# Altium schematic sheet Power.SchDoc (part 2 of 3)
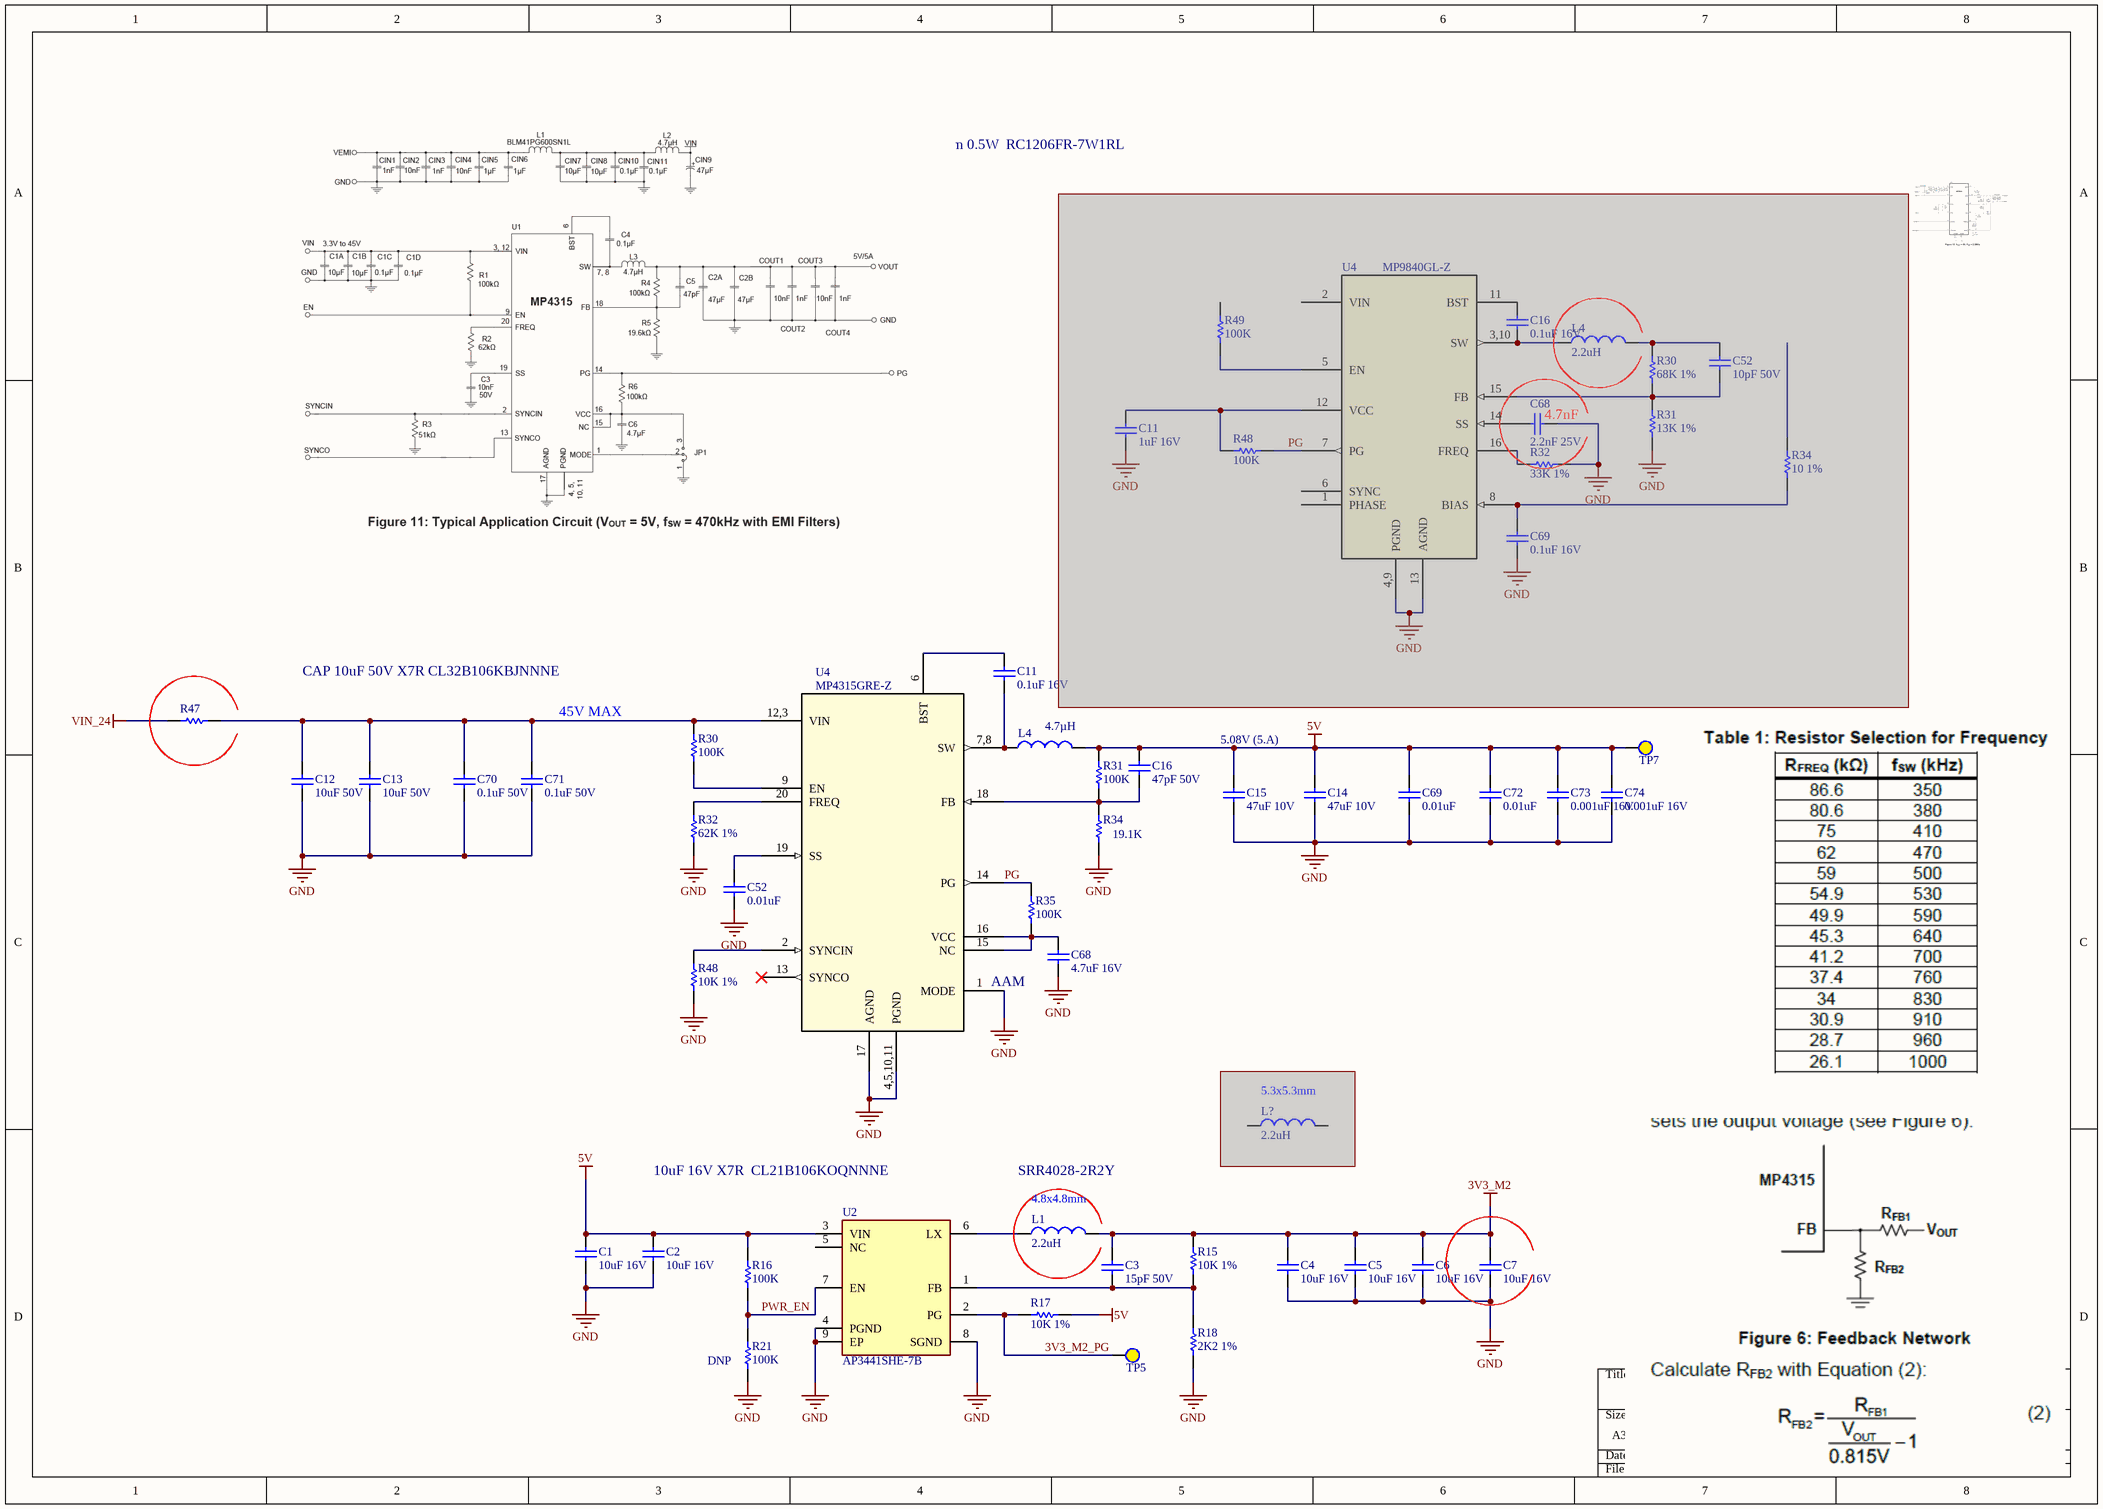
[diagram p1: Power.SchDoc]
## Library data of the parts
C1 C2 C4-C7 = Cap10UF_16V_0805_X7R: 16V 10uF X7R ±10% 0805 Multilayer Ceramic Capacitors MLCC - SMD/SMT ROHS; Manufacturer: Samsung Electro-Mechanics; Manufacturer Part Number: CL21B106KOQNNNE; Value: 10µF; Supplier 1: Mouser; Supplier Part Number 1: 187-CL21B106KOQNNNE; Supplier: Mouser; Supplier Part Number: 187-CL21B106KOQNNNE; RoHS: Compliant; Category: Ceramic Capacitors; Stock: 602217; Pricing: 1=0.22, 1=0.189, 10=0.133, 10=0.114, 50=0.133, 100=0.069, 100=0.08, 500=0.055, 1000=0.054, 1000=0.046, 2000=0.046, 4000=0.04, 10000=0.044, 10000=0.038, 24000=0.037 (USD); ComponentLink1URL: https://datasheet.octopart.com:443/CL21B106KOQNNNE-Samsung-Electro-Mechanics-datasheet-136482503.pdf?src-supplier=IHS; ComponentLink1Description: https://datasheet.octopart.com:443/CL21B106KOQNNNE-Samsung-Electro-Mechanics-datasheet-136482503.pdf?src-supplier=IHS; Case/Package: 0805; Case Code (Imperial): 0805; Case Code (Metric): 2012; China RoHS: Compliant; Contact Plating: Tin; Depth: 1.25mm; Dielectric: X7R; Dielectric Material: Ceramic; Height: 1.4mm; Length: 2mm; Lifecycle Status: Production; Material: Ceramic; Max Operating Temperature: 125°C; Min Operating Temperature: -55°C; Mounting Technology: Surface Mount; Number of Terminals: 2; Radiation Hardening: No; REACH SVHC: Yes; Schedule B: 8532240020, 8532240020|8532240020, 8532240020|8532240020|8532240020, 8532240020|8532240020|8532240020|8532240020; Thickness: 1.397mm; Tolerance: 10%; Voltage: 16V; Voltage Rating: 16V; Voltage Rating (DC): 16V; Width: 1.25mm; ComponentLink2URL: https://datasheet.octopart.com:443/CL21B106KOQNNNE-Samsung-Electro-Mechanics-datasheet-116891046.pdf?src-supplier=Future+Electronics; ComponentLink2Description: https://datasheet.octopart.com:443/CL21B106KOQNNNE-Samsung-Electro-Mechanics-datasheet-116891046.pdf?src-supplier=Future+Electronics; ComponentLink3URL: https://datasheet.octopart.com:443/CL21B106KOQNNNE-Samsung-Electro-Mechanics-datasheet-81462191.pdf?src-supplier=Future+Electronics; ComponentLink3Description: https://datasheet.octopart.com:443/CL21B106KOQNNNE-Samsung-Electro-Mechanics-datasheet-81462191.pdf?src-supplier=Future+Electronics; ComponentLink4URL: https://datasheet.octopart.com:443/CL21B106KOQNNNE-Samsung-datasheet-12530662.pdf?src-supplier=Future+Electronics; ComponentLink4Description: https://datasheet.octopart.com:443/CL21B106KOQNNNE-Samsung-datasheet-12530662.pdf?src-supplier=Future+Electronics; ComponentLink5URL: https://datasheet.octopart.com:443/CL21B106KOQNNNE-Samsung-datasheet-26669285.pdf?src-supplier=Future+Electronics; ComponentLink5Description: https://datasheet.octopart.com:443/CL21B106KOQNNNE-Samsung-datasheet-26669285.pdf?src-supplier=Future+Electronics; ComponentLink6URL: https://datasheet.octopart.com:443/CL21B106KOQNNNE-Samsung-Electro-Mechanics-datasheet-149045986.pdf?src-supplier=Future+Electronics; ComponentLink6Description: https://datasheet.octopart.com:443/CL21B106KOQNNNE-Samsung-Electro-Mechanics-datasheet-149045986.pdf?src-supplier=Future+Electronics; ComponentLink7URL: https://datasheet.octopart.com/CL21B106KOQNNNE-Samsung-Electro-Mechanics-datasheet-97040617.pdf; ComponentLink7Description: https://datasheet.octopart.com/CL21B106KOQNNNE-Samsung-Electro-Mechanics-datasheet-97040617.pdf; ComponentLink8URL: https://datasheet.octopart.com/CL21B106KOQNNNE-Samsung-Electro-Mechanics-datasheet-8324245.pdf; ComponentLink8Description: https://datasheet.octopart.com/CL21B106KOQNNNE-Samsung-Electro-Mechanics-datasheet-8324245.pdf; ComponentLink9URL: https://datasheet.octopart.com/General-Multilayer-Ceramic-Capacitors-Samsung-datasheet-family-111.pdf; ComponentLink9Description: https://datasheet.octopart.com/General-Multilayer-Ceramic-Capacitors-Samsung-datasheet-family-111.pdf; ComponentLink10URL: https://datasheet.octopart.com:443/CL21B106KOQNNNE-Samsung-Electro-Mechanics-datasheet-11806859.pdf?src-supplier=Arrow+Electronics; ComponentLink10Description: https://datasheet.octopart.com:443/CL21B106KOQNNNE-Samsung-Electro-Mechanics-datasheet-11806859.pdf?src-supplier=Arrow+Electronics; ComponentLink11URL: https://datasheet.octopart.com:443/CL21B106KOQNNNE-Samsung-datasheet-8326407.pdf?src-supplier=TME; ComponentLink11Description: https://datasheet.octopart.com:443/CL21B106KOQNNNE-Samsung-datasheet-8326407.pdf?src-supplier=TME; ComponentLink12URL: http://sigma.octopart.com:80/rohs_certificate/General-Multilayer-Ceramic-Capacitors-Samsung-family-110.pdf?src-supplier=Compliance+Statements; ComponentLink12Description: http://sigma.octopart.com:80/rohs_certificate/General-Multilayer-Ceramic-Capacitors-Samsung-family-110.pdf?src-supplier=Compliance+Statements; ComponentLink13URL: http://sigma.octopart.com:80/rohs_statement/General-Multilayer-Ceramic-Capacitors-Samsung-family-132.pdf?src-supplier=Compliance+Statements; ComponentLink13Description: http://sigma.octopart.com:80/rohs_statement/General-Multilayer-Ceramic-Capacitors-Samsung-family-132.pdf?src-supplier=Compliance+Statements; ComponentLink14URL: http://sigma.octopart.com:80/reach_statement/General-Multilayer-Ceramic-Capacitors-Samsung-family-133.pdf?src-supplier=Compliance+Statements; ComponentLink14Description: http://sigma.octopart.com:80/reach_statement/General-Multilayer-Ceramic-Capacitors-Samsung-family-133.pdf?src-supplier=Compliance+Statements
C3 = Cap15PF_50V: Multilayer Ceramic Capacitor, 15 pF, 50 V, ± 5%, C0G (NP0), 0402 [1005 Metric]; Manufacturer: KEMET; Manufacturer Part Number: C0402C150J5GACTU; Material: 4241ConductorMaterial; Temperature Coefficient: 30ppm/°C; Dissipation Factor: 0.1%; Supplier 1: Mouser; Supplier Part Number 1: 80-C0402C150J5G; Supplier: Mouser; Supplier Part Number: 80-C0402C150J5G; RoHS: Yes; Category: Ceramic Capacitors; Stock: 101858; Pricing: 1=0.1, 10=0.017, 50=0.017, 100=0.009, 1000=0.007, 10000=0.004 (USD); Mounting Technology: Surface Mount,PCB; Case/Package: 0402; Pins: 2; Case Code (Imperial): 0402; Case Code (Metric): 1005; Min Operating Temperature: -55°C; Max Operating Temperature: 125°C; Voltage Rating (DC): 50V; Value: 15pF; Tolerance: 5%; Packaging: Tape and Reel; Dielectric: C0G; Voltage Rating: 50V; Package Quantity: 10000; Termination: SMD/SMT; Series: SMD Comm C0G; Construction: Flat; Voltage Rating (AC): 50V; Length: 1mm; Width: 0.5mm; Height: 0.5mm; Lead Pitch: 0.3mm; Depth: 0.5mm; Radiation Hardening: No; Reach SVHC Compliant: No; Lead Free: 5697LeadFree; RoHS Compliant: Yes; ComponentLink1URL: https://datasheet.ciiva.com/6136/1725418-6136193.pdf?src-supplier=Farnell; ComponentLink1Description: https://datasheet.ciiva.com/6136/1725418-6136193.pdf?src-supplier=Farnell; ComponentLink2URL: https://datasheet.ciiva.com/7378/1372242-7378502.pdf?src-supplier=Newark; ComponentLink2Description: https://datasheet.ciiva.com/7378/1372242-7378502.pdf?src-supplier=Newark; ComponentLink3URL: https://datasheet.ciiva.com/7747/1725418-7747461.pdf?src-supplier=Element14; ComponentLink3Description: https://datasheet.ciiva.com/7747/1725418-7747461.pdf?src-supplier=Element14; ComponentLink4URL: https://datasheet.ciiva.com/5712/kem-c1003-c0g-smd-5712268.pdf?src-supplier=Farnell; ComponentLink4Description: https://datasheet.ciiva.com/5712/kem-c1003-c0g-smd-5712268.pdf?src-supplier=Farnell; ComponentLink5URL: https://datasheet.ciiva.com/7747/kem-c1003-c0g-smd-7747625.pdf?src-supplier=Element14; ComponentLink5Description: https://datasheet.ciiva.com/7747/kem-c1003-c0g-smd-7747625.pdf?src-supplier=Element14; ComponentLink6URL: https://datasheet.ciiva.com/32378/kemet-c0402cxx-eng-tds-32378380.pdf?src-supplier=Distrelec; ComponentLink6Description: https://datasheet.ciiva.com/32378/kemet-c0402cxx-eng-tds-32378380.pdf?src-supplier=Distrelec; ComponentLink7URL: https://datasheet.ciiva.com/28645/1789732-28645400.pdf?src-supplier=Element14; ComponentLink7Description: https://datasheet.ciiva.com/28645/1789732-28645400.pdf?src-supplier=Element14; ComponentLink8URL: https://datasheet.ciiva.com/14588/70095383-14588188.pdf?src-supplier=Allied+Electronics; ComponentLink8Description: https://datasheet.ciiva.com/14588/70095383-14588188.pdf?src-supplier=Allied+Electronics; ComponentLink9URL: https://datasheet.ciiva.com/5414/kem-c1003-c0g-smd-356956-5414360.pdf?src-supplier=Mouser; ComponentLink9Description: https://datasheet.ciiva.com/5414/kem-c1003-c0g-smd-356956-5414360.pdf?src-supplier=Mouser; ComponentLink10URL: https://datasheet.ciiva.com/18192/getdatasheetpartid-94368-18192437.pdf?src-supplier=Verical; ComponentLink10Description: https://datasheet.ciiva.com/18192/getdatasheetpartid-94368-18192437.pdf?src-supplier=Verical
C11#1 = Cap1UF_16V: Ceramic Capacitor (Surface Mount); Manufacturer: Taiyo Yuden; Manufacturer Part Number: EMK105BJ105KV-F; Capacitance: 1µF; Tolerance: ±10%; Temperature Coefficient: X5R; Supplier 1: Digi-Key; RoHS: RoHS Compliant; Category: Capacitors; Stock 1: 107475; Pricing 1: 1=0.1, 10=0.06, 50=0.0326, 100=0.0275, 250=0.02252, 500=0.01926, 1000=0.015, 5000=0.0125 (USD); Packaging: Cut Tape (CT); Voltage - Rated: 16V; Mounting Type: Surface Mount, MLCC; Operating Temperature: -55°C ~ 85°C; Applications: General Purpose; Ratings: -; Package / Case: 0402 (1005 Metric); Size / Dimension: 0.039" L x 0.020" W (1.00mm x 0.50mm); Height - Seated (Max): -; Thickness (Max): 0.022" (0.55mm); Lead Spacing: -; Features: -; Lead Style: -; ComponentLink1URL: http://ds.yuden.co.jp/TYCOMPAS/ut/detail.do?productNo=EMK105BJ105KV-F&fileName=EMK105BJ105KV-F_SS&mode=specSheetDownload; ComponentLink1Description: http://ds.yuden.co.jp/TYCOMPAS/ut/detail.do?productNo=EMK105BJ105KV-F&fileName=EMK105BJ105KV-F_SS&mode=specSheetDownload; Supplier Part Number 1: 587-2477-1-ND
C11#2 C16#1 C69#1 = Cap0.1UF_16V_X7R: 0402 0.1 uF 16V ±10% Tolerance X7R SMT Multilayer Ceramic Capacitor; Manufacturer: Murata; Manufacturer Part Number: GCM155R71C104KA55J; Value: 100nF; RoHS: Yes; Category: Ceramic Capacitors; Stock 1: 2121057; Pricing 1: 1=0,10000, 10=0,01800, 50=0,01800, 100=0,01500, 1000=0,00900, 10000=0,00700 (USD); Mounting Technology: Surface Mount; Case/Package: 0402; Case Code (Imperial): 0402; Case Code (Metric): 1005; Min Operating Temperature: -55°C; Max Operating Temperature: 125°C; Tolerance: 10%; Voltage Rating: 16V; Voltage Rating (DC): 16V; Packaging: Tape and Reel; Package Quantity: 1; Dielectric: X7R; Termination: SMD/SMT; Series: GCM; Construction: Flat; Length: 1mm; Width: 0.5mm; Height: 0.5mm; Thickness: 0.022inch; Depth: 0.5mm; Ratings: AEC-Q200; Radiation Hardening: No; Lead Free: Lead Free; RoHS Compliant: Yes; ComponentLink1URL: https://datasheet.ciiva.com/11618/product-11618848.pdf?src-supplier=Avnet; ComponentLink1Description: https://datasheet.ciiva.com/11618/product-11618848.pdf?src-supplier=Avnet; ComponentLink2URL: https://datasheet.ciiva.com/16440/gcm155r71c104ka55j-16440393.pdf?src-supplier=Future+Electronics; ComponentLink2Description: https://datasheet.ciiva.com/16440/gcm155r71c104ka55j-16440393.pdf?src-supplier=Future+Electronics; ComponentLink3URL: https://datasheet.ciiva.com/29542/product-29542474.pdf?src-supplier=Digi-Key; ComponentLink3Description: https://datasheet.ciiva.com/29542/product-29542474.pdf?src-supplier=Digi-Key; ComponentLink4URL: https://datasheet.ciiva.com/29542/product-29542475.pdf?src-supplier=Digi-Key; ComponentLink4Description: https://datasheet.ciiva.com/29542/product-29542475.pdf?src-supplier=Digi-Key; Supplier 1: Mouser; Supplier 2: Digi-Key; Supplier Part Number 1: 81-GCM155R71C104KA5J; Supplier Part Number 2: 490-7998-1-ND
C12 C13 = Cap_10uF_50V_1210: Ceramic Capacitor, Multilayer, Ceramic, 50V, 10% +Tol, 10% -Tol, X7R, +-15% TC, 10uF, Surface Mount, 1210 inch; Manufacturer: Samsung Electro-Mechanics; Manufacturer Part Number: CL32B106KBJNNNE; Value: 10µF; Supplier: Mouser; Supplier Part Number: 187-CL32B106KBJNNNE; RoHS: Compliant; Category: Ceramic Capacitors; Stock: 42744; Pricing: 1=0.27, 1=0.232, 10=0.137, 10=0.205, 50=0.137, 100=0.137, 1000=0.112, 1000=0.205, 2000=0.201, 5000=0.197, 10000=0.112, 10000=0.15 (USD); Case/Package: 1210; Material: Ceramic; Min Operating Temperature: -55°C; Max Operating Temperature: 125°C; Tolerance: 10%; Voltage Rating: 50V; Voltage Rating (DC): 50V; Height: 2.7mm; Supplier 1: Mouser; Supplier Part Number 1: 187-CL32B106KBJNNNE; Case Code (Imperial): 1210; Case Code (Metric): 3225; China RoHS: Compliant; Depth: 2.5mm; Dielectric: X7R; Dielectric Material: Ceramic; Lead Free: Lead Free; Length: 3.2mm; Lifecycle Status: Production; Mounting Technology: Surface Mount; Number of Terminals: 2; Radiation Hardening: No; REACH SVHC: Yes; Schedule B: 8532240020, 8532240020|8532240020|8532240020|8532240020|8532240020|8532240020|8532240020|8532240020|8532240020, 8532240020|8532240020|8532240020|8532240020|8532240020|8532240020|8532240020|8532240020|8532240020|8532240020, 8532240020|8532240020|8532240020|8532240020|8532240020|8532240020|8532240020|8532240020|8532240020|8532240020|8532240020; Thickness: 2.6924mm; Voltage: 50V; Width: 2.5mm; ComponentLink1URL: https://datasheet.octopart.com:443/CL32B106KBJNNNE-Samsung-Electro-Mechanics-datasheet-136482661.pdf?src-supplier=Newark; ComponentLink1Description: https://datasheet.octopart.com:443/CL32B106KBJNNNE-Samsung-Electro-Mechanics-datasheet-136482661.pdf?src-supplier=Newark; ComponentLink2URL: https://datasheet.octopart.com:443/CL32B106KBJNNNE-Samsung-Electro-Mechanics-datasheet-136482663.pdf?src-supplier=Newark; ComponentLink2Description: https://datasheet.octopart.com:443/CL32B106KBJNNNE-Samsung-Electro-Mechanics-datasheet-136482663.pdf?src-supplier=Newark; ComponentLink3URL: https://datasheet.octopart.com:443/CL32B106KBJNNNE-Samsung-Electro-Mechanics-datasheet-149049182.pdf?src-supplier=Future+Electronics; ComponentLink3Description: https://datasheet.octopart.com:443/CL32B106KBJNNNE-Samsung-Electro-Mechanics-datasheet-149049182.pdf?src-supplier=Future+Electronics; ComponentLink4URL: https://datasheet.octopart.com:443/CL32B106KBJNNNE-Samsung-Electro-Mechanics-datasheet-116891145.pdf?src-supplier=Future+Electronics; ComponentLink4Description: https://datasheet.octopart.com:443/CL32B106KBJNNNE-Samsung-Electro-Mechanics-datasheet-116891145.pdf?src-supplier=Future+Electronics; ComponentLink5URL: https://datasheet.octopart.com:443/CL32B106KBJNNNE-Samsung-Electro-Mechanics-datasheet-68304316.pdf?src-supplier=Future+Electronics; ComponentLink5Description: https://datasheet.octopart.com:443/CL32B106KBJNNNE-Samsung-Electro-Mechanics-datasheet-68304316.pdf?src-supplier=Future+Electronics; ComponentLink6URL: https://datasheet.octopart.com:443/CL32B106KBJNNNE-Samsung-datasheet-66660282.pdf?src-supplier=Future+Electronics; ComponentLink6Description: https://datasheet.octopart.com:443/CL32B106KBJNNNE-Samsung-datasheet-66660282.pdf?src-supplier=Future+Electronics; ComponentLink7URL: https://datasheet.octopart.com:443/CL32B106KBJNNNE-Samsung-datasheet-58578005.pdf?src-supplier=Future+Electronics; ComponentLink7Description: https://datasheet.octopart.com:443/CL32B106KBJNNNE-Samsung-datasheet-58578005.pdf?src-supplier=Future+Electronics; ComponentLink8URL: https://datasheet.octopart.com:443/CL32B106KBJNNNE-Samsung-datasheet-37081328.pdf?src-supplier=Future+Electronics; ComponentLink8Description: https://datasheet.octopart.com:443/CL32B106KBJNNNE-Samsung-datasheet-37081328.pdf?src-supplier=Future+Electronics; ComponentLink9URL: https://datasheet.octopart.com/CL32B106KBJNNNE-Samsung-Electro-Mechanics-datasheet-97040617.pdf; ComponentLink9Description: https://datasheet.octopart.com/CL32B106KBJNNNE-Samsung-Electro-Mechanics-datasheet-97040617.pdf; ComponentLink10URL: https://datasheet.octopart.com/CL32B106KBJNNNE-Samsung-Electro-Mechanics-datasheet-8324245.pdf; ComponentLink10Description: https://datasheet.octopart.com/CL32B106KBJNNNE-Samsung-Electro-Mechanics-datasheet-8324245.pdf; ComponentLink11URL: https://datasheet.octopart.com/General-Multilayer-Ceramic-Capacitors-Samsung-datasheet-family-111.pdf; ComponentLink11Description: https://datasheet.octopart.com/General-Multilayer-Ceramic-Capacitors-Samsung-datasheet-family-111.pdf; ComponentLink12URL: https://datasheet.octopart.com:443/CL32B106KBJNNNE-Samsung-datasheet-151956608.pdf?src-supplier=SOS+electronic; ComponentLink12Description: https://datasheet.octopart.com:443/CL32B106KBJNNNE-Samsung-datasheet-151956608.pdf?src-supplier=SOS+electronic; ComponentLink13URL: https://datasheet.octopart.com:443/CL32B106KBJNNNE-Samsung-Electro-Mechanics-datasheet-11770601.pdf?src-supplier=Arrow+Electronics; ComponentLink13Description: https://datasheet.octopart.com:443/CL32B106KBJNNNE-Samsung-Electro-Mechanics-datasheet-11770601.pdf?src-supplier=Arrow+Electronics; ComponentLink14URL: https://datasheet.octopart.com:443/CL32B106KBJNNNE-Samsung-datasheet-8326407.pdf?src-supplier=TME; ComponentLink14Description: https://datasheet.octopart.com:443/CL32B106KBJNNNE-Samsung-datasheet-8326407.pdf?src-supplier=TME; ComponentLink15URL: http://sigma.octopart.com:80/rohs_certificate/General-Multilayer-Ceramic-Capacitors-Samsung-family-110.pdf?src-supplier=Compliance+Statements; ComponentLink15Description: http://sigma.octopart.com:80/rohs_certificate/General-Multilayer-Ceramic-Capacitors-Samsung-family-110.pdf?src-supplier=Compliance+Statements; ComponentLink16URL: http://sigma.octopart.com:80/rohs_statement/General-Multilayer-Ceramic-Capacitors-Samsung-family-132.pdf?src-supplier=Compliance+Statements; ComponentLink16Description: http://sigma.octopart.com:80/rohs_statement/General-Multilayer-Ceramic-Capacitors-Samsung-family-132.pdf?src-supplier=Compliance+Statements; ComponentLink17URL: http://sigma.octopart.com:80/reach_statement/General-Multilayer-Ceramic-Capacitors-Samsung-family-133.pdf?src-supplier=Compliance+Statements; ComponentLink17Description: http://sigma.octopart.com:80/reach_statement/General-Multilayer-Ceramic-Capacitors-Samsung-family-133.pdf?src-supplier=Compliance+Statements
C14 C15 = Cap47UF_10V_1210_X7R: Multilayer Ceramic Capacitor, 47 uF, 10 V, ± 20%, X7R, 1210 [3225 Metric]; Manufacturer: Murata; Manufacturer Part Number: GRM32ER71A476ME15L; Material: 4241ConductorMaterial; Height: 2.5mm; Supplier 1: Mouser; RoHS: Yes; Category: Ceramic Capacitors; Mounting Technology: Surface Mount; Case/Package: 1210; Case Code (Metric): 3225; Case Code (Imperial): 1210; Min Operating Temperature: -55°C; Max Operating Temperature: 125°C; Packaging: Tape and Reel; Value: 47uF; Voltage Rating: 10V; Tolerance: 20%; Series: GRM; Length: 3.2mm; Width: 0.098inch; Thickness: 0.106inch; RoHS Compliant: Yes; ComponentLink1URL: https://datasheet.ciiva.com/46441/1754712-46441338.pdf?src-supplier=Element14; ComponentLink1Description: https://datasheet.ciiva.com/46441/1754712-46441338.pdf?src-supplier=Element14; ComponentLink2URL: https://datasheet.ciiva.com/6264/partnumbering-e-01-6264587.pdf?src-supplier=Digikey; ComponentLink2Description: https://datasheet.ciiva.com/6264/partnumbering-e-01-6264587.pdf?src-supplier=Digikey; Supplier Part Number 1: 81-GRM32ER71A476ME5L; Supplier: Mouser; Supplier Part Number: 81-GRM32ER71A476ME5L; Stock: 13198; Pricing: 1=0.85, 10=0.545, 50=0.545, 100=0.436, 1000=0.313, 10000=0.26 (USD); Dielectric: X7R; Package Quantity: 1; Voltage Rating (DC): 10V; Termination: SMD/SMT; Voltage: 10V; Construction: Flat; Depth: 2.5mm; Radiation Hardening: No; Reach SVHC Compliant: No; Lead Free: Lead Free; ComponentLink3URL: https://datasheet.ciiva.com/6264/partnumbering-e-01-6264586.pdf?src-supplier=Digikey; ComponentLink3Description: https://datasheet.ciiva.com/6264/partnumbering-e-01-6264586.pdf?src-supplier=Digikey; ComponentLink4URL: https://datasheet.ciiva.com/6264/partnumbering-e-01-6264588.pdf?src-supplier=Digikey; ComponentLink4Description: https://datasheet.ciiva.com/6264/partnumbering-e-01-6264588.pdf?src-supplier=Digikey; ComponentLink5URL: https://datasheet.ciiva.com/11606/product-11606523.pdf?src-supplier=Avnet; ComponentLink5Description: https://datasheet.ciiva.com/11606/product-11606523.pdf?src-supplier=Avnet; ComponentLink6URL: https://datasheet.ciiva.com/16497/product-16497006.pdf?src-supplier=Future+Electronics; ComponentLink6Description: https://datasheet.ciiva.com/16497/product-16497006.pdf?src-supplier=Future+Electronics
C16#2 = Cap47PF_50V: Ceramic Capacitor (Surface Mount); Manufacturer: Johanson Dielectrics Inc.; Manufacturer Part Number: 500R07N470JV4T; Tolerance: ±5%; Temperature Coefficient: C0G, NP0; Supplier 1: Mouser; Supplier Part Number 1: 187-CL05C470JB51PNC; RoHS: RoHS Compliant; Category: Capacitors; Stock 1: 49773; Pricing 1: 1=0.1, 10=0.034, 25=0.024, 50=0.0182, 100=0.0154, 250=0.0126, 500=0.01078, 1000=0.0084, 2500=0.00756 (USD); Packaging: Cut Tape (CT); Capacitance: 47pF; Voltage - Rated: 50V; Mounting Type: Surface Mount, MLCC; Operating Temperature: -55°C ~ 125°C; Applications: General Purpose; Ratings: -; Package / Case: 0402 (1005 Metric); Size / Dimension: 0.040" L x 0.020" W (1.02mm x 0.51mm); Height - Seated (Max): -; Thickness (Max): 0.025" (0.64mm); Lead Spacing: -; Features: -; Lead Style: -; ComponentLink1URL: http://www.johansondielectrics.com/downloads/jdi-product-catalog.pdf; ComponentLink1Description: http://www.johansondielectrics.com/downloads/jdi-product-catalog.pdf; Supplier 2: DigiKey; Supplier Part Number 2: 709-1121-1-ND
C52#1 = Cap10PF_50V: Ceramic Capacitor (Surface Mount); Manufacturer: Kemet; Manufacturer Part Number: CBR04C100J5GAC; Tolerance: ±5%; Temperature Coefficient: C0G, NP0; Supplier 1: Digi-Key; RoHS: RoHS Compliant; Category: Capacitors; Stock 1: 19679; Pricing 1: 1=0.12, 10=0.086, 25=0.0644, 50=0.0492, 100=0.0407, 250=0.03428, 1000=0.0231, 2500=0.02121, 5000=0.01953 (USD); Packaging: Cut Tape (CT); Capacitance: 10pF; Voltage - Rated: 50V; Mounting Type: Surface Mount, MLCC; Operating Temperature: -55°C ~ 125°C; Applications: RF, Microwave, High Frequency; Ratings: -; Package / Case: 0402 (1005 Metric); Size / Dimension: 0.039" L x 0.020" W (1.00mm x 0.50mm); Height - Seated (Max): -; Thickness (Max): 0.022" (0.55mm); Lead Spacing: -; Features: High Q, Low Loss; Lead Style: -; ComponentLink1URL: http://www.kemet.com/Lists/ProductCatalog/Attachments/490/KEM_C1030_CBR_SMD.pdf; ComponentLink1Description: http://www.kemet.com/Lists/ProductCatalog/Attachments/490/KEM_C1030_CBR_SMD.pdf; Supplier Part Number 1: 399-6168-1-ND
C52#2 C69#2 C72 = Cap0.01UF_10V_X7R: CAP, 0.01µF, 10V, 10%, X7R, 0402; Manufacturer: Wurth Electronics; Manufacturer Part Number: 885012205012; Capacitance: 10nF; ComponentLink1URL: http://product.tdk.com/en/catalog/datasheets/mlcc_commercial_general_en.pdf; ComponentLink1Description: http://product.tdk.com/en/catalog/datasheets/mlcc_commercial_general_en.pdf; Supplier 1: Digi-Key; RoHS: Yes; Category: Ceramic Capacitors; Stock 1: 49906; Pricing 1: 1=0,10000, 10=0,01000, 100=0,00890, 500=0,00790 (USD); Mount: Surface Mount; Case/Package: 0402; Case Code (Imperial): 0402; Case Code (Metric): 1005; Min Operating Temperature: -55°C; Max Operating Temperature: 125°C; Tolerance: 10%; Packaging: Tape and Reel; Voltage Rating: 10V; Length: 0.039inch; Width: 0.02inch; Thickness: 0.022inch; ComponentLink2URL: http://www.farnell.com/datasheets/2031788.pdf?src-supplier=Farnell; ComponentLink2Description: http://www.farnell.com/datasheets/2031788.pdf?src-supplier=Farnell; ComponentLink3URL: http://katalog.we-online.de/pbs/datasheet/885012205012.pdf?src-supplier=Digi-Key; ComponentLink3Description: http://katalog.we-online.de/pbs/datasheet/885012205012.pdf?src-supplier=Digi-Key; ComponentLink4URL: https://katalog.we-online.de/pbs/datasheet/885012205012.pdf?src-supplier=Digi-Key; ComponentLink4Description: https://katalog.we-online.de/pbs/datasheet/885012205012.pdf?src-supplier=Digi-Key; ComponentLink5URL: http://www.farnell.com/datasheets/2031788.pdf?src-supplier=Element14; ComponentLink5Description: http://www.farnell.com/datasheets/2031788.pdf?src-supplier=Element14; ComponentLink6URL: http://www.farnell.com/datasheets/2031788.pdf?src-supplier=Newark; ComponentLink6Description: http://www.farnell.com/datasheets/2031788.pdf?src-supplier=Newark; Supplier Part Number 1: 732-7507-1-ND
C68#1 = Cap2.2nF_25V_C0G: Cap Cer 0402 2.2NF 25V C0G 20%; Manufacturer: KEMET; Manufacturer Part Number: C0402C222M3GECAUTO; Supplier 1: Mouser; RoHS: No; Category: Ceramic Capacitors; Stock 1: 18017; Pricing 1: 1=0,12600, 10=0,05800, 100=0,03600, 500=0,03000, 1000=0,02400, 2000=0,02100, 10000=0,01800, 1=0,14000, 10=0,06400, 100=0,04000, 500=0,03300, 1000=0,02700, 2000=0,02300 (EUR); ComponentLink1URL: https://api.kemet.com/component-edge/download/datasheet/C0402C222M3GECAUTO.pdf?src-supplier=Digi-Key; ComponentLink1Description: https://api.kemet.com/component-edge/download/datasheet/C0402C222M3GECAUTO.pdf?src-supplier=Digi-Key; Supplier Part Number 1: 80-C0402C222M3GECAUT; Supplier 2: Digi-Key; Supplier Part Number 2: 399-17555-1-ND
C68#2 = Cap4.7UF_16_0603: Ceramic Capacitor (Surface Mount); Manufacturer: Samsung Electro-Mechanics America, Inc.; Manufacturer Part Number: CL10A475KO8NNNC; Capacitance: 4.7µF; Tolerance: ±10%; Temperature Coefficient: X5R; Supplier 1: Digi-Key; RoHS: RoHS Compliant; Category: Capacitors; Stock 1: 166451; Pricing 1: 1=0.26, 10=0.216, 25=0.1484, 50=0.1216, 100=0.108, 500=0.07156, 1000=0.06345 (USD); Packaging: Cut Tape (CT); Voltage - Rated: 16V; Mounting Type: Surface Mount, MLCC; Operating Temperature: -55°C ~ 85°C; Applications: General Purpose; Ratings: -; Package / Case: 0603 (1608 Metric); Size / Dimension: 0.063" L x 0.031" W (1.60mm x 0.80mm); Height - Seated (Max): -; Thickness (Max): 0.035" (0.90mm); Lead Spacing: -; Features: -; Lead Style: -; ComponentLink1URL: http://www.samsungsem.com/kr/support/product-search/mlcc/CL10A475KO8NNNC.jsp; ComponentLink1Description: http://www.samsungsem.com/kr/support/product-search/mlcc/CL10A475KO8NNNC.jsp; Supplier Part Number 1: 1276-1784-1-ND
C70 C71 = Cap0.1uF_50V_0603: Ceramic Capacitor, Multilayer, Ceramic, 50V, 10% +Tol, 10% -Tol, X7R, +-15% TC, 100nF, Surface Mount, 0603 inch; Manufacturer: Samsung Electro-Mechanics; Manufacturer Part Number: CL10B104KB8NNWC; Supplier: Mouser; Supplier Part Number: 187-CL10B104KB8NNWC; RoHS: Compliant; Category: Ceramic Capacitors; Stock: 1855989; Pricing: 1=0.1, 1=0.086, 10=0.005, 10=0.004, 50=0.005, 100=0.004, 100=0.003, 1000=0.004, 4000=0.003, 10000=0.003 (USD); Value: 100nF; Case/Package: 0603; Case Code (Imperial): 0603; Case Code (Metric): 1608; China RoHS: Compliant; Contact Plating: Tin; Dielectric: X7R; Dielectric Material: Ceramic; Height: 900µm; Length: 1.6002mm; Lifecycle Status: Production; Material: Ceramic; Max Operating Temperature: 125°C; Min Operating Temperature: -55°C; Mounting Technology: Surface Mount; Number of Terminals: 2; Packaging: Tape & Reel (TR); REACH SVHC: Yes; Schedule B: 8532240020, 8532240020|8532240020|8532240020|8532240020|8532240020|8532240020|8532240020|8532240020|8532240020|8532240020|8532240020|8532240020|8532240020|8532240020|8532240020|8532240020|8532240020|8532240020|8532240020|8532240020|8532240020|8532240020|8532240020|85; Termination: Wraparound; Thickness: 889µm; Tolerance: 10%; Voltage Rating: 50V; Voltage Rating (DC): 50V; Width: 787.4µm; ComponentLink1URL: https://datasheet.octopart.com:443/CL10B104KB8NNWC-Samsung-Electro-Mechanics-datasheet-182019694.pdf?src-supplier=IHS; ComponentLink1Description: https://datasheet.octopart.com:443/CL10B104KB8NNWC-Samsung-Electro-Mechanics-datasheet-182019694.pdf?src-supplier=IHS; ComponentLink2URL: https://datasheet.octopart.com:443/CL10B104KB8NNWC-Samsung-datasheet-8326407.pdf?src-supplier=TME; ComponentLink2Description: https://datasheet.octopart.com:443/CL10B104KB8NNWC-Samsung-datasheet-8326407.pdf?src-supplier=TME; ComponentLink3URL: https://datasheet.octopart.com:443/CL10B104KB8NNWC-Samsung-Electro-Mechanics-datasheet-149136785.pdf?src-supplier=Future+Electronics; ComponentLink3Description: https://datasheet.octopart.com:443/CL10B104KB8NNWC-Samsung-Electro-Mechanics-datasheet-149136785.pdf?src-supplier=Future+Electronics; Supplier 1: Mouser; Supplier Part Number 1: 187-CL10B104KB8NNWC
C73 C74 = Cap0.001UF_16V: Ceramic Capacitor (Surface Mount); Manufacturer: Yageo; Manufacturer Part Number: CC0402KRX7R7BB102; Capacitance: 1000pF; Tolerance: ±10%; Temperature Coefficient: X7R; Supplier 1: Digi-Key; RoHS: RoHS Compliant; Category: Capacitors; Stock 1: 393001; Pricing 1: 1=0.1, 10=0.011, 25=0.0076, 100=0.0049, 250=0.004, 500=0.00342, 1000=0.00267, 2500=0.0024, 5000=0.00223 (USD); Packaging: Cut Tape (CT); Voltage - Rated: 16V; Mounting Type: Surface Mount, MLCC; Operating Temperature: -55°C ~ 125°C; Applications: General Purpose; Ratings: -; Package / Case: 0402 (1005 Metric); Size / Dimension: 0.039" L x 0.020" W (1.00mm x 0.50mm); Height - Seated (Max): -; Thickness (Max): 0.022" (0.55mm); Lead Spacing: -; Features: -; Lead Style: -; ComponentLink1URL: http://www.yageo.com/documents/recent/UPY-GPHC_X7R_6.3V-to-50V-v12.pdf; ComponentLink1Description: http://www.yageo.com/documents/recent/UPY-GPHC_X7R_6.3V-to-50V-v12.pdf; Supplier Part Number 1: 311-1352-1-ND
L1 = INDUCTOR_2.2uH_2.5A_SRR4028-2R2Y: Inductor Power Shielded Wirewound 2.2uH 30% 100KHz 9.24Q-Factor Ferrite 2.5A 28mOhm DCR T/R; Manufacturer_Name: Bourns; DC Resistance (DCR): 28mΩ; Value: 2.2µH; Number of Circuits: 1; Q Factor: 9.24; Saturation Current: 2.05A; Self Resonant Frequency: 111MHz; Shielding: Yes; Datasheet Link: https://www.bourns.com/pdfs/SRR4028.pdf; Manufacturer_Part_Number: SRR4028-2R2Y; Mouser Part Number: 652-SRR4028-2R2Y; Mouser Price/Stock: https://www.mouser.co.uk/ProductDetail/Bourns/SRR4028-2R2Y?qs=s%252BX%2FYkvGCpG9Z7V%252B7hX5uA%3D%3D; Arrow Part Number: SRR4028-2R2Y; Arrow Price/Stock: https://www.arrow.com/en/products/srr4028-2r2y/bourns?region=nac; Supplier: Mouser; Supplier Part Number: 652-SRR4028-2R2Y; Manufacturer: Bourns; Manufacturer Part Number: SRR4028-2R2Y; RoHS: Compliant; Category: Fixed Inductors; Stock: 67; Pricing: 1=0.57, 1=0.49, 10=0.469, 10=0.403, 25=0.398, 50=0.463, 100=0.397, 100=0.341, 250=0.316, 500=0.316, 1000=0.337, 1000=0.29, 2500=0.275, 10000=0.32 (USD); Case/Package: 1919; Case Code (Imperial): 1919; Case Code (Metric): 4848; China RoHS: Compliant; Composition: Wirewound; Core Material: Ferrite; Current Rating: 2.5A; DC Current: 2.5A; Depth: 5mm; Height: 2.8mm; Height - Seated (Max): 2.9972mm; Inductance Tolerance: 30%; Length: 4.8006mm; Lifecycle Status: Production; Max Current Rating: 2.5A; Max DC Current: 2.5A; Max Operating Temperature: 125°C; Military Standard: Not; Min Operating Temperature: -40°C; Mounting Technology: Surface Mount; Number of Terminals: 2; Radiation Hardening: No; REACH SVHC: Yes; RMS Current (Irms): 2.5A; Schedule B: 8504500000, 8504500000|8504500000|8504500000|8504500000|8504500000; Termination: SMD/SMT; Test Frequency: 100kHz; Tolerance: 30%; Width: 4.8mm; ComponentLink1URL: https://datasheet.octopart.com:443/SRR4028-2R2Y-Bourns-datasheet-154729989.pdf?src-supplier=element14+APAC; ComponentLink1Description: https://datasheet.octopart.com:443/SRR4028-2R2Y-Bourns-datasheet-154729989.pdf?src-supplier=element14+APAC; ComponentLink2URL: https://datasheet.octopart.com:443/SRR4028-2R2Y-Bourns-datasheet-13386804.pdf?src-supplier=element14+APAC; ComponentLink2Description: https://datasheet.octopart.com:443/SRR4028-2R2Y-Bourns-datasheet-13386804.pdf?src-supplier=element14+APAC; ComponentLink3URL: https://datasheet.octopart.com:443/SRR4028-2R2Y-Bourns-datasheet-142044744.pdf?src-supplier=RS+(Formerly+Allied+Electronics); ComponentLink3Description: https://datasheet.octopart.com:443/SRR4028-2R2Y-Bourns-datasheet-142044744.pdf?src-supplier=RS+(Formerly+Allied+Electronics); ComponentLink4URL: http://sigma.octopart.com:80/conflict_mineral_statement/Bourns-company-36.pdf?src-supplier=Compliance+Statements; ComponentLink4Description: http://sigma.octopart.com:80/conflict_mineral_statement/Bourns-company-36.pdf?src-supplier=Compliance+Statements; Supplier 1: Mouser; Supplier Part Number 1: 652-SRR4028-2R2Y
L4#1 L? = Inductor_2.2uH_3.75A: WE-LQS SMT Semi-Shielded Power Inductor; Manufacturer: Wurth Electronics; Core Material: Ferrite; Inductance Tolerance: 30%; Current Rating: 3.75A; Saturation Current: 5.6A; DC Resistance (DCR): 20mR; Self Resonant Frequency: 69MHz; Test Frequency: 100kHz; ComponentLink1URL: http://search.murata.co.jp/Ceramy/image/img/PDF/ENG/L0075S0104LQM2HP_G0.pdf; ComponentLink1Description: http://search.murata.co.jp/Ceramy/image/img/PDF/ENG/L0075S0104LQM2HP_G0.pdf; Supplier: Mouser; Supplier Part Number: 710-74404063022; Manufacturer Part Number: 74404063022; RoHS: Yes; Category: Fixed Inductors; Stock: 1594; Pricing: 1=1.2, 10=1.2, 50=1.1, 100=1.1, 1000=0.74, 10000=0.739 (USD); Mounting Technology: Surface Mount; Case/Package: Nonstandard; Min Operating Temperature: -40°C; Max Operating Temperature: 125°C; Packaging: Tape and Reel; Value: 2.2uH; Shielding: Shielded; RMS Current (Irms): 3.75A; Tolerance: 30%; Termination: SMD/SMT; Max DC Current: 3.75A; Package Quantity: 2000; Series: WE-LQS; Length: 0.236inch; Width: 6mm; Height: 2.8mm; Height - Seated (Max): 0.11inch; RoHS Compliant: Yes; Reach SVHC Compliant: Unknown; ComponentLink2URL: http://www.farnell.com/datasheets/1832895.pdf?src-supplier=Farnell; ComponentLink2Description: http://www.farnell.com/datasheets/1832895.pdf?src-supplier=Farnell; ComponentLink3URL: http://www.mouser.com/ds/2/445/74404063022-321643.pdf?src-supplier=Mouser; ComponentLink3Description: http://www.mouser.com/ds/2/445/74404063022-321643.pdf?src-supplier=Mouser; ComponentLink4URL: http://www.farnell.com/datasheets/1832895.pdf?src-supplier=Element14; ComponentLink4Description: http://www.farnell.com/datasheets/1832895.pdf?src-supplier=Element14; ComponentLink5URL: https://katalog.we-online.de/pbs/datasheet/74404063022.pdf?src-supplier=Digikey; ComponentLink5Description: https://katalog.we-online.de/pbs/datasheet/74404063022.pdf?src-supplier=Digikey; Supplier 1: Mouser; Supplier Part Number 1: 710-74404063022
L4#2 = INDUCTOR_MGAH06034R7M-10: General Purpose Inductor, 4.7uH, 20%, 1 Element, Metal Composite-Core, SMD, 2826; Manufacturer_Name: Laird Performance Materials; Manufacturer: Laird; DC Resistance (DCR): 38mΩ; Max Current Rating: 5.5A; Number of Circuits: 1; Shielding: Yes; Test Frequency: 100kHz; Datasheet Link: https://www.mouser.com/datasheet/2/987/MGAH0603_2520Series-3043308.pdf; Height: 3.1mm; Manufacturer_Part_Number: MGAH06034R7M-10; Mouser Part Number: 739-MGAH06034R7M-10; Mouser Price/Stock: https://www.mouser.co.uk/ProductDetail/Laird-Performance-Materials/MGAH06034R7M-10?qs=By6Nw2ByBD0cDCaE8LireQ%3D%3D; Supplier: Mouser; Supplier Part Number: 739-MGAH06034R7M-10; Manufacturer Part Number: MGAH06034R7M-10; RoHS: Compliant; Category: Fixed Inductors; Stock: 7363; Pricing: 1=0.58, 1=0.499, 10=0.491, 10=0.422, 25=0.388, 50=0.451, 100=0.365, 100=0.314, 250=0.297, 1000=0.262, 1000=0.225, 5000=0.218, 10000=0.232, 10000=0.2 (USD); Case/Package: 2826; Lifecycle Status: Production; Max Operating Temperature: 155°C; Min Operating Temperature: -55°C; Number of Terminals: 2; REACH SVHC: Yes; Tolerance: 20%; Width: 6.6mm; ComponentLink1URL: https://datasheet.octopart.com:443/MGAH06034R7M-10-Laird-datasheet-169352260.pdf?src-supplier=IHS; ComponentLink1Description: https://datasheet.octopart.com:443/MGAH06034R7M-10-Laird-datasheet-169352260.pdf?src-supplier=IHS; ComponentLink2URL: http://sigma.octopart.com:80/conflict_mineral_statement/Laird-company-56.pdf?src-supplier=Compliance+Statements; ComponentLink2Description: http://sigma.octopart.com:80/conflict_mineral_statement/Laird-company-56.pdf?src-supplier=Compliance+Statements; Supplier 1: Mouser; Supplier Part Number 1: 739-MGAH06034R7M-10
R15 R17 R48#2 = Res_10K_0402: Resistor; Manufacturer: Yageo; Manufacturer Part Number: RC0402FR-0710KL; Power (Watts): 0.063W, 1/16W; Temperature Coefficient: ±100ppm/°C; Supplier 1: Digi-Key; RoHS: RoHS Compliant; Category: Resistors; Stock 1: 2634839; Pricing 1: 1=0.1, 10=0.013, 25=0.0096, 100=0.0054, 250=0.00412, 500=0.00328, 1000=0.00242, 2500=0.0021, 5000=0.00173 (USD); Packaging: Cut Tape (CT); Resistance (Ohms): 10k; Tolerance: ±1%; Composition: Thick Film; Features: Moisture Resistant; Operating Temperature: -55°C ~ 155°C; Package / Case: 0402 (1005 Metric); Supplier Device Package: 0402; Size / Dimension: 0.039" L x 0.020" W (1.00mm x 0.50mm); Height: 0.016" (0.40mm); Number of Terminations: 2; ComponentLink1URL: http://www.yageo.com/NewPortal/yageodocoutput?fileName=/pdf/R-Chip/PYu-RC_Group_51_RoHS_L_3.pdf; ComponentLink1Description: http://www.yageo.com/NewPortal/yageodocoutput?fileName=/pdf/R-Chip/PYu-RC_Group_51_RoHS_L_3.pdf; Supplier Part Number 1: 311-10.0KLRCT-ND; MountType: SMT
R16 R21 R30#2 R31#2 R35 R48#1 R49 = Res_100K_0402: Resistor; Manufacturer: Stackpole Electronics Inc; Manufacturer Part Number: RMCF0402FT100K; Tolerance: ±1%; Power (Watts): 0.063W, 1/16W; Temperature Coefficient: ±100ppm/°C; Value: 100K; Supplier 1: Digi-Key; RoHS: RoHS Compliant; Category: Resistors; Stock 1: 272042; Pricing 1: 1=0.1, 10=0.025, 50=0.0138, 100=0.0105, 250=0.0078, 500=0.00576, 1000=0.00384, 2500=0.00324, 5000=0.0027 (USD); Packaging: Cut Tape (CT); Resistance (Ohms): 100k; Composition: Thick Film; Features: Automotive AEC-Q200; Operating Temperature: -55°C ~ 155°C; Package / Case: 0402 (1005 Metric); Supplier Device Package: 0402; Size / Dimension: 0.039" L x 0.020" W (1.00mm x 0.50mm); Height: 0.016" (0.40mm); Number of Terminations: 2; ComponentLink1URL: http://www.seielect.com/Catalog/SEI-RMCF_RMCP.pdf; ComponentLink1Description: http://www.seielect.com/Catalog/SEI-RMCF_RMCP.pdf; Supplier Part Number 1: RMCF0402FT100KCT-ND; Part Status: Active; Height - Seated (Max): 0.016" (0.40mm); Failure Rate: -; ComponentLink2URL: http://www.yageo.com/documents/recent/PYu-RC_Group_51_RoHS_L_7.pdf; ComponentLink2Description: http://www.yageo.com/documents/recent/PYu-RC_Group_51_RoHS_L_7.pdf; MountType: SMT
R18 = Res_2K2_0402: SMD Chip Resistor, 2.2 kOhm, ± 1%, 63 mW, 0402 [1005 Metric], Thick Film, Anti-Sulfur; Manufacturer: Yageo; Manufacturer Part Number: AF0402FR-072K2L; Value: 2.2kR; Temperature Coefficient: 100ppm/°C; Max Power Dissipation: 63mW; Voltage Rating: 50V; Supplier: Mouser; Supplier Part Number: 603-AF0402FR-072K2L; RoHS: Yes; Category: Chip SMD Resistors; Stock: 30667; Pricing: 1=0.1, 10=0.017, 50=0.017, 100=0.014, 1000=0.011, 10000=0.005 (USD); Case/Package: 0402; Min Operating Temperature: -55°C; Max Operating Temperature: 155°C; Tolerance: 1%; Packaging: Tape and Reel; Number of Terminations: 2; Series: AF; RoHS Compliant: Yes; ComponentLink1URL: http://www.yageo.com/documents/recent/PYu-AF_51_RoHS_L_5.pdf?src-supplier=Digikey; ComponentLink1Description: http://www.yageo.com/documents/recent/PYu-AF_51_RoHS_L_5.pdf?src-supplier=Digikey; Supplier 1: Mouser; Supplier Part Number 1: 603-AF0402FR-072K2L; Features: Moisture Resistant,Anti-Sulfur; Length: 0.039inch; Width: 0.02inch; Height: 0.015inch
R30#1 = Res_68K_0402: Resistor; Manufacturer: Yageo; Manufacturer Part Number: RC0402FR-0768KL; Power (Watts): 0.063W, 1/16W; Temperature Coefficient: ±100ppm/°C; Supplier 1: Digi-Key; RoHS: RoHS Compliant; Category: Resistors; Stock 1: 722463; Pricing 1: 1=0.1, 10=0.013, 25=0.0092, 50=0.007, 100=0.0051, 250=0.00392, 500=0.00314, 1000=0.00231, 5000=0.00166 (USD); Packaging: Cut Tape (CT); Part Status: Active; Resistance (Ohms): 68k; Tolerance: ±1%; Composition: Thick Film; Features: Moisture Resistant; Operating Temperature: -55°C ~ 155°C; Package / Case: 0402 (1005 Metric); Supplier Device Package: 0402; Size / Dimension: 0.039" L x 0.020" W (1.00mm x 0.50mm); Height - Seated (Max): 0.016" (0.40mm); Failure Rate: -; ComponentLink1URL: http://www.yageo.com/documents/recent/PYu-RC_Group_51_RoHS_L_7.pdf; ComponentLink1Description: http://www.yageo.com/documents/recent/PYu-RC_Group_51_RoHS_L_7.pdf; Supplier Part Number 1: 311-68.0KLRCT-ND; MountType: SMT
R31#1 = Res_13K_0402: SMD Chip Resistor, 13 kOhm, ± 1%, 63 mW, 0402 [1005 Metric], Thick Film, General Purpose; Manufacturer: Yageo; Manufacturer Part Number: RC0402FR-0713KL; Value: 13kR; Power Rating: 62.5mW; Voltage Rating: 50V; Temperature Coefficient: 100ppm/°C; Max Power Dissipation: 63mW; Supplier: Mouser; Supplier Part Number: 603-RC0402FR-0713KL; RoHS: Yes; Category: Chip SMD Resistors; Stock: 50018; Pricing: 1=0.1, 10=0.007, 50=0.007, 100=0.004, 1000=0.003, 10000=0.002 (USD); Mounting Technology: Surface Mount; Case/Package: 0402; Case Code (Metric): 1005; Case Code (Imperial): 0402; Min Operating Temperature: -55°C; Max Operating Temperature: 155°C; Tolerance: 1%; Package Quantity: 10000; Packaging: Tape and Reel; Number of Terminations: 2; Termination: SMD/SMT; Voltage Rating (DC): 50V; Working Voltage: 50V; Features: Moisture Resistant; Series: RC; Technology: THICK FILM; Length: 0.039inch; Width: 0.02inch; Height: 0.016inch; Depth: 0.5mm; Lead Free: Lead Free; RoHS Compliant: Yes; ComponentLink1URL: https://datasheet.ciiva.com/11808/0900766b80c66297-11808220.pdf?src-supplier=Rs; ComponentLink1Description: https://datasheet.ciiva.com/11808/0900766b80c66297-11808220.pdf?src-supplier=Rs; ComponentLink2URL: https://datasheet.ciiva.com/2453/pyu-r-int-thick-7-2453492.pdf?src-supplier=Digikey; ComponentLink2Description: https://datasheet.ciiva.com/2453/pyu-r-int-thick-7-2453492.pdf?src-supplier=Digikey; ComponentLink3URL: https://datasheet.ciiva.com/2453/pyu-r-int-thick-7-2453491.pdf?src-supplier=Digikey; ComponentLink3Description: https://datasheet.ciiva.com/2453/pyu-r-int-thick-7-2453491.pdf?src-supplier=Digikey; Supplier 1: Mouser; Supplier Part Number 1: 603-RC0402FR-0713KL
R32#1 = Res_33K_0402: Resistor 33K 1% 0402; Manufacturer: Bourns; Manufacturer Part Number: CR0402-FX-3302GLF; Resistance: 33kR; Power Rating: 62.5mW; Voltage Rating: 50V; Temperature Coefficient: 100ppm/°C; Max Power Dissipation: 63mW; Supplier 1: Mouser; Supplier Part Number 1: 652-CR0402FX-3302GLF; Stock 1: 44297; Pricing 1: 1=0,10000, 10=0,02200, 50=0,02200, 100=0,01300, 1000=0,00800, 10000=0,00500 (USD); RoHS: Yes; Mount: Surface Mount; Case/Package: 0402; Case Code (Imperial): 0402; Case Code (Metric): 1005; Contact Plating: Tin; Min Operating Temperature: -55°C; Max Operating Temperature: 125°C; Tolerance: 1%; Packaging: Tape and Reel; Package Quantity: 10000; Composition: Thick Film; Termination: SMD/SMT; Number of Terminations: 2; Military Standard: Not; Length: 1mm; Height: 0.016inch; Width: 0.5mm; Depth: 0.5mm; Thickness: 356um; Radiation Hardening: No; ComponentLink1URL: https://datasheet.ciiva.com/30211/445cr0402-30211989.pdf?src-supplier=Onlinecomponents.com; ComponentLink1Description: https://datasheet.ciiva.com/30211/445cr0402-30211989.pdf?src-supplier=Onlinecomponents.com; ComponentLink2URL: https://datasheet.ciiva.com/9121/cr0402-9121560.pdf?src-supplier=Avnet; ComponentLink2Description: https://datasheet.ciiva.com/9121/cr0402-9121560.pdf?src-supplier=Avnet; ComponentLink3URL: https://datasheet.ciiva.com/18608/cr0402-18608765.pdf?src-supplier=Digi-Key; ComponentLink3Description: https://datasheet.ciiva.com/18608/cr0402-18608765.pdf?src-supplier=Digi-Key; ComponentLink4URL: https://datasheet.ciiva.com/18608/cr0402-18608766.pdf?src-supplier=Digi-Key; ComponentLink4Description: https://datasheet.ciiva.com/18608/cr0402-18608766.pdf?src-supplier=Digi-Key; ComponentLink5URL: https://datasheet.ciiva.com/18608/cr0402-18608767.pdf?src-supplier=Digi-Key; ComponentLink5Description: https://datasheet.ciiva.com/18608/cr0402-18608767.pdf?src-supplier=Digi-Key; MountType: SMT
R32#2 = Res_62K_0402: Res Thick Film 0402 62K Ohm 1% 0.063W(1/16W) ±100ppm/C Pad SMD T/R Automotive AEC-Q200; Manufacturer: Yageo Group; Manufacturer Part Number: AC0402FR-0762KL; Max Power Dissipation: 63mW; Power Dissipation: 62.5mW; Value: 62kΩ; Temperature Coefficient: 100ppm/°C; Voltage Rating: 50V; Supplier: Mouser; Supplier Part Number: 603-AC0402FR-0762KL; RoHS: Compliant; Category: Chip SMD Resistors; Stock: 345381; Pricing: 1=0.1, 1=0.086, 10=0.008, 10=0.007, 50=0.008, 100=0.005, 100=0.004, 1000=0.005, 10000=0.005, 10000=0.004, 20000=0.003 (USD); Case/Package: 0402; China RoHS: Non-Compliant; Composition: Thick Film; Features: Automotive AEC-Q200, Moisture Resistant; Height: 320µm; Lead Free: Lead Free; Length: 990.6µm; Lifecycle Status: Production; Max Operating Temperature: 155°C; Min Operating Temperature: -55°C; Mounting Technology: Surface Mount; Number of Terminals: 2; Number of Terminations: 2; Packaging: Tape & Reel; Power Rating: 62.5mW; REACH SVHC: Yes; Schedule B: 8533210045, 8533210045|8533210045|8533210045|8533210045|8533210045; Tolerance: 1%; Width: 500µm; Working Voltage: 50V; ComponentLink1URL: https://datasheet.octopart.com:443/AC0402FR-0762KL-Yageo-datasheet-182189377.pdf?src-supplier=IHS; ComponentLink1Description: https://datasheet.octopart.com:443/AC0402FR-0762KL-Yageo-datasheet-182189377.pdf?src-supplier=IHS; ComponentLink2URL: https://datasheet.octopart.com:443/AC0402FR-0762KL-Yageo-datasheet-83209224.pdf?src-supplier=Upverter; ComponentLink2Description: https://datasheet.octopart.com:443/AC0402FR-0762KL-Yageo-datasheet-83209224.pdf?src-supplier=Upverter; ComponentLink3URL: https://datasheet.octopart.com:443/AC0402FR-0762KL-Yageo-datasheet-178509465.pdf?src-supplier=Farnell; ComponentLink3Description: https://datasheet.octopart.com:443/AC0402FR-0762KL-Yageo-datasheet-178509465.pdf?src-supplier=Farnell; ComponentLink4URL: https://datasheet.octopart.com/AC0402FR-0762KL-Yageo-datasheet-12512238.pdf; ComponentLink4Description: https://datasheet.octopart.com/AC0402FR-0762KL-Yageo-datasheet-12512238.pdf; ComponentLink5URL: https://datasheet.octopart.com:443/AC0402FR-0762KL-Yageo-datasheet-166720450.pdf?src-supplier=Future+Electronics; ComponentLink5Description: https://datasheet.octopart.com:443/AC0402FR-0762KL-Yageo-datasheet-166720450.pdf?src-supplier=Future+Electronics; ComponentLink6URL: https://datasheet.octopart.com:443/AC0402FR-0762KL-Yageo-datasheet-151884373.pdf?src-supplier=Future+Electronics; ComponentLink6Description: https://datasheet.octopart.com:443/AC0402FR-0762KL-Yageo-datasheet-151884373.pdf?src-supplier=Future+Electronics; ComponentLink7URL: https://datasheet.octopart.com:443/AC0402FR-0762KL-Yageo-datasheet-137699919.pdf?src-supplier=Future+Electronics; ComponentLink7Description: https://datasheet.octopart.com:443/AC0402FR-0762KL-Yageo-datasheet-137699919.pdf?src-supplier=Future+Electronics; ComponentLink8URL: https://datasheet.octopart.com:443/AC0402FR-0762KL-Yageo-datasheet-24580492.pdf?src-supplier=Future+Electronics; ComponentLink8Description: https://datasheet.octopart.com:443/AC0402FR-0762KL-Yageo-datasheet-24580492.pdf?src-supplier=Future+Electronics; ComponentLink9URL: https://datasheet.octopart.com:443/AC0402FR-0762KL-Yageo-datasheet-13029202.pdf?src-supplier=Future+Electronics; ComponentLink9Description: https://datasheet.octopart.com:443/AC0402FR-0762KL-Yageo-datasheet-13029202.pdf?src-supplier=Future+Electronics; ComponentLink10URL: https://datasheet.octopart.com:443/AC0402FR-0762KL-Yageo-Group-datasheet-164768995.pdf?src-supplier=ODG+(Origin+Data+Global); ComponentLink10Description: https://datasheet.octopart.com:443/AC0402FR-0762KL-Yageo-Group-datasheet-164768995.pdf?src-supplier=ODG+(Origin+Data+Global); ComponentLink11URL: https://datasheet.octopart.com:443/AC0402FR-0762KL-Yageo-datasheet-128678426.pdf?src-supplier=X-ON; ComponentLink11Description: https://datasheet.octopart.com:443/AC0402FR-0762KL-Yageo-datasheet-128678426.pdf?src-supplier=X-ON; ComponentLink12URL: http://sigma.octopart.com:80/rohs_statement/Yageo-company-2.pdf?src-supplier=Compliance+Statements; ComponentLink12Description: http://sigma.octopart.com:80/rohs_statement/Yageo-company-2.pdf?src-supplier=Compliance+Statements; ComponentLink13URL: http://sigma.octopart.com:80/conflict_mineral_statement/Yageo-company-3.pdf?src-supplier=Compliance+Statements; ComponentLink13Description: http://sigma.octopart.com:80/conflict_mineral_statement/Yageo-company-3.pdf?src-supplier=Compliance+Statements; Supplier 1: Mouser; Supplier Part Number 1: 603-AC0402FR-0762KL
R34#1 = Res_10R_0402: Resistor; Manufacturer: Yageo; Manufacturer Part Number: RC0402FR-0710RL; Resistance (Ohms): 10; Power (Watts): 0.063W, 1/16W; Temperature Coefficient: ±200ppm/°C; Supplier 1: Digi-Key; RoHS: RoHS Compliant; Category: Resistors; Stock 1: 1485168; Pricing 1: 1=0.1, 10=0.013, 25=0.0096, 100=0.0054, 250=0.00412, 500=0.00328, 1000=0.00242, 2500=0.0021, 5000=0.00173 (USD); Packaging: Cut Tape (CT); Tolerance: ±1%; Composition: Thick Film; Features: Moisture Resistant; Operating Temperature: -55°C ~ 155°C; Package / Case: 0402 (1005 Metric); Supplier Device Package: 0402; Size / Dimension: 0.039" L x 0.020" W (1.00mm x 0.50mm); Height: 0.016" (0.40mm); Number of Terminations: 2; ComponentLink1URL: http://www.yageo.com/documents/recent/PYu-RC_Group_51_RoHS_L_2.pdf; ComponentLink1Description: http://www.yageo.com/documents/recent/PYu-RC_Group_51_RoHS_L_2.pdf; Supplier Part Number 1: 311-10.0LRCT-ND; MountType: SMT